# EasyEDA Pro project SprinKlr-8 Rev1.epro, schematic Schematic1
Board Name: Board1; Create Date: 2026-05-14; Page Name: P1; Project Name: SprinKlr-8 (John Sierra); Schematic Name: Schematic1; Update Date: 2026-05-18; Company: SprinKlr-8; Drawn: 15-May 2026; Page Size: A2; Version: V1.0
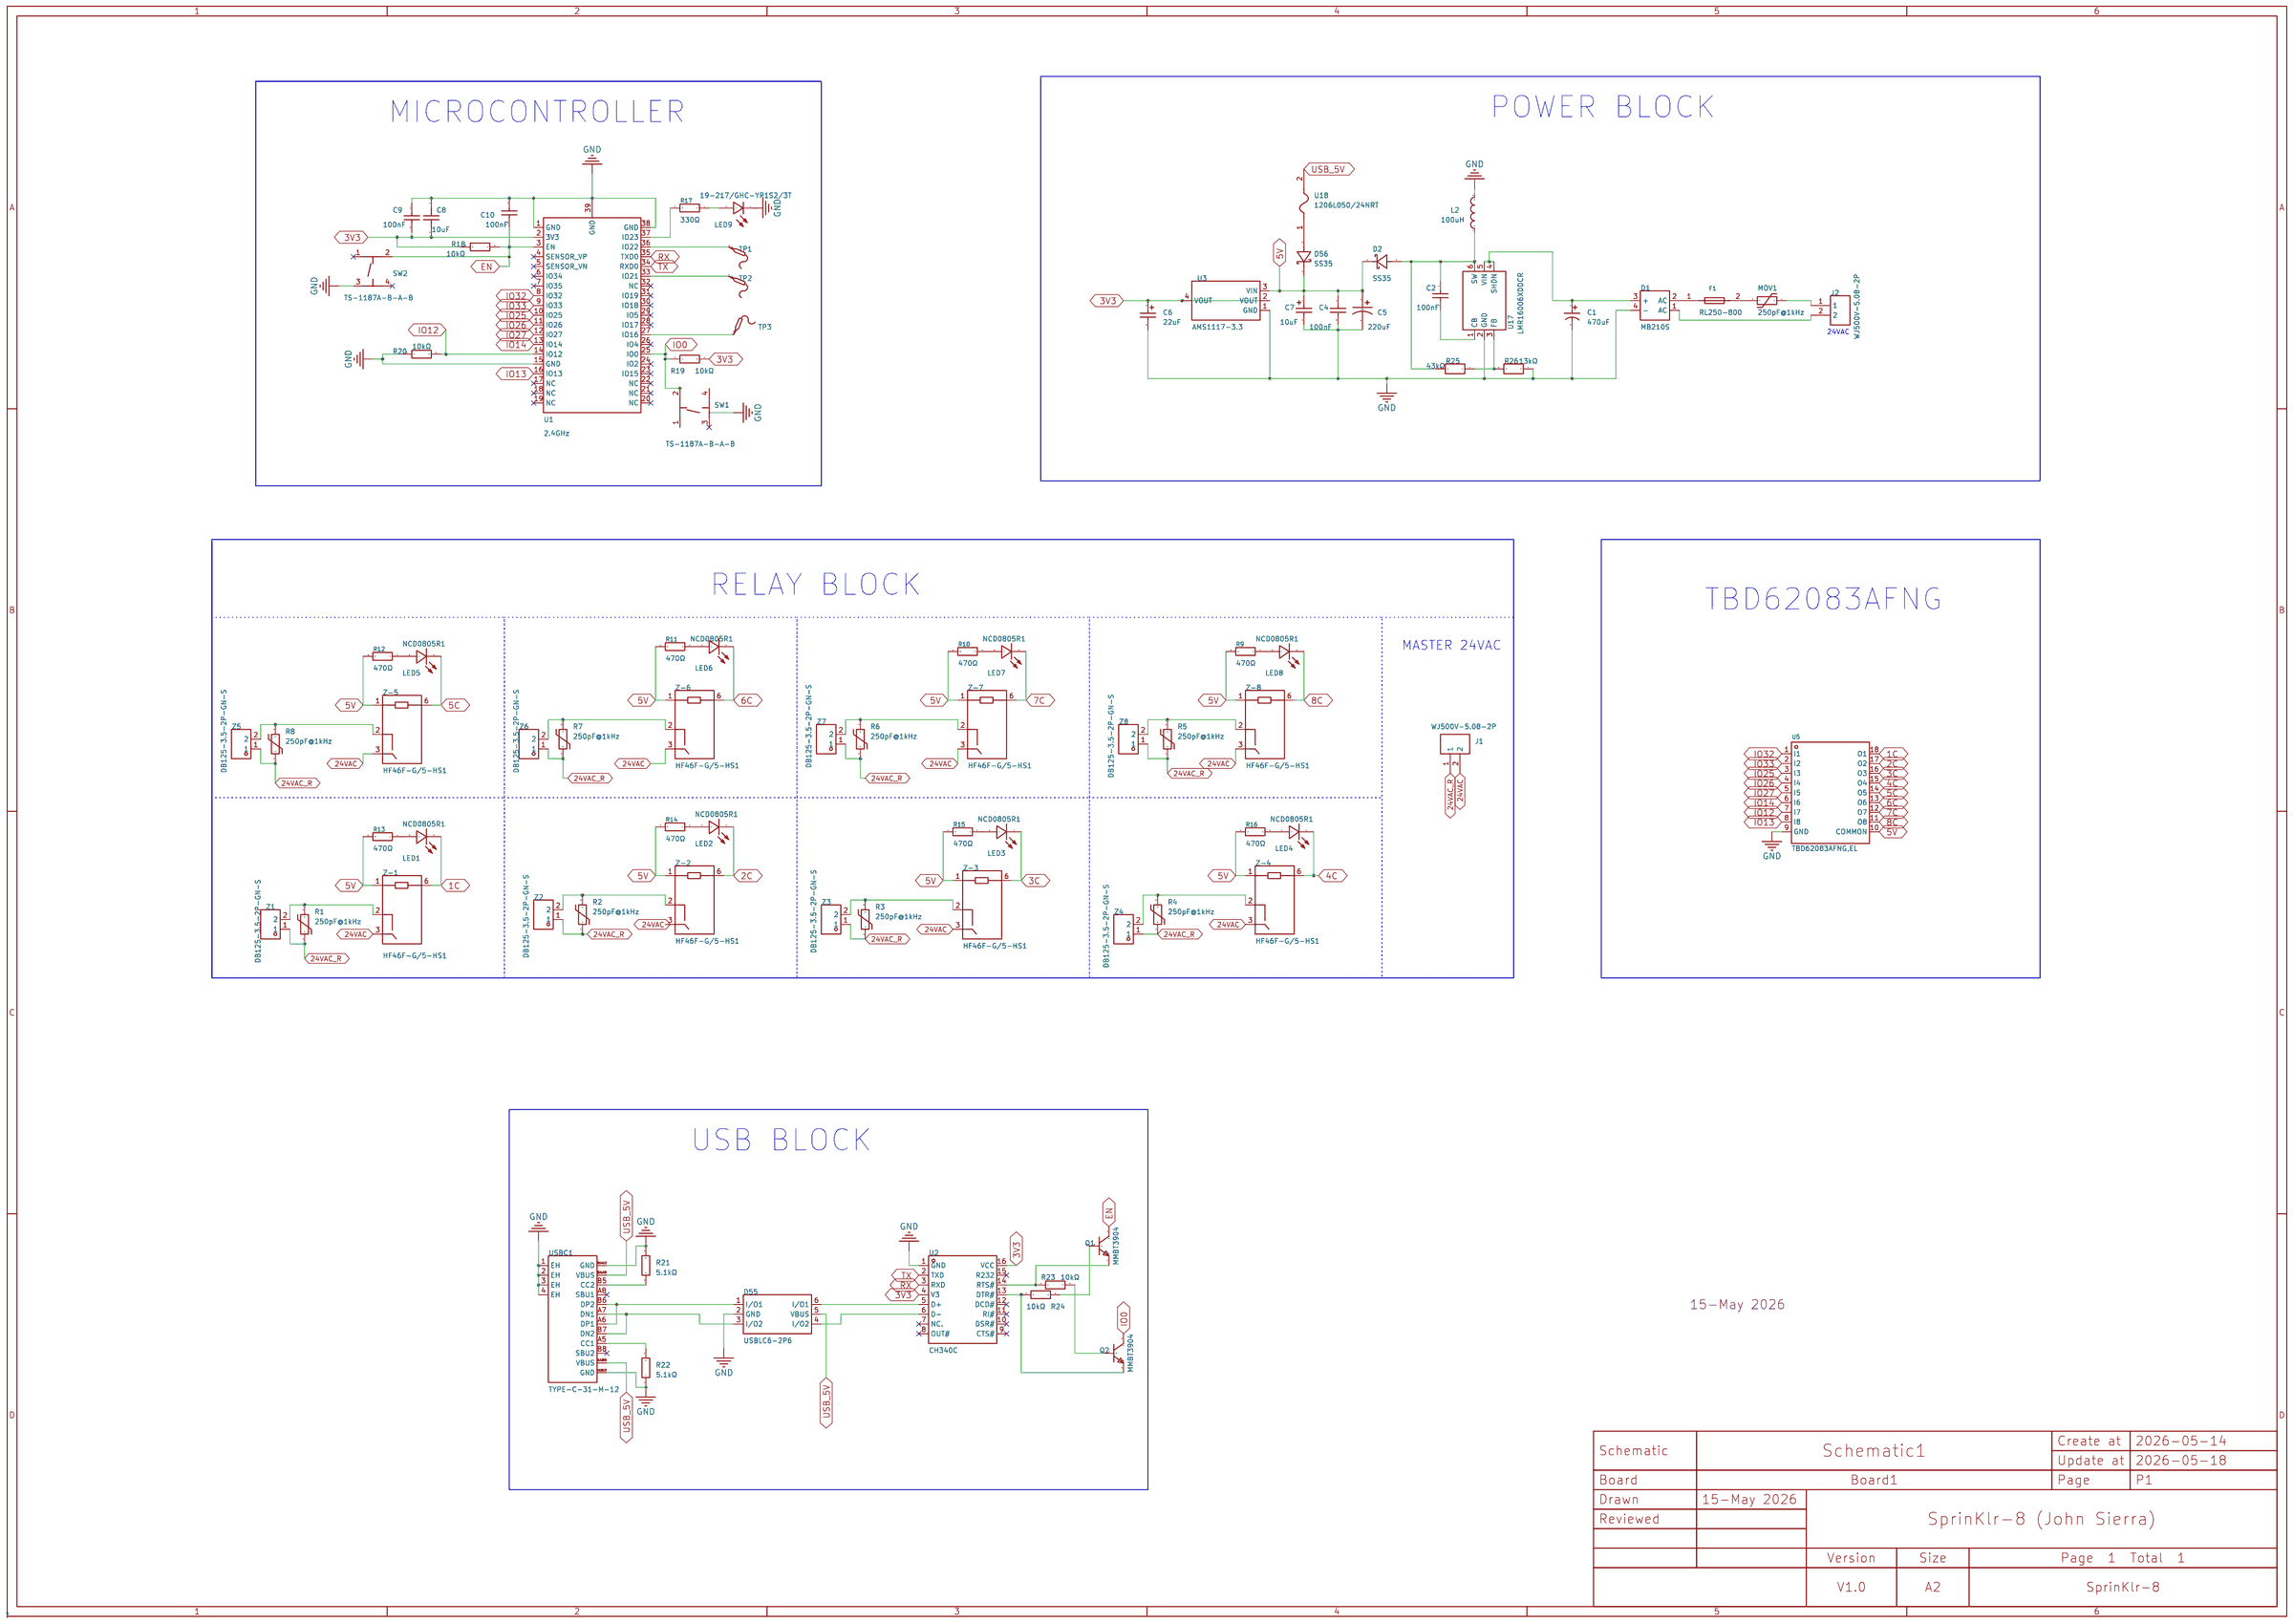
[diagram p0: schematic sheet]

## Parts
C1  470uF  [CAP-TH_BD13.0-P5.00-D1.2-FD]
C2  100nF  [C0805]
C4  100nF  [C0805]
C5  220uF  [CAP-TH_BD10.0-P5.00-D1.0-FD]
C6  22uF  [CASE-A_3216]
C7  10uF  [CAP-SMD_L3.2-W1.6-RD-C7171]
C8  10uF  [C0805]
C9  100nF  [C0805]
C10  100nF  [C0805]
D1  MB210S  [MBS_L4.7-W4.0-P2.50-LS7.0-BL]
D2  SS35  [SMC_L6.9-W5.9-LS7.9-RD]
D55  USBLC6-2P6  [SOT-666-6_L1.6-W1.2-P0.50-LS1.6-BL]
D56  SS35  [SMC_L6.9-W5.9-LS7.9-RD]
F1  RL250-800  [FUSE-TH_L20.0-W4.5-P5.10-D0.8-S3.70]
J1  WJ500V-5.08-2P  [CONN-TH_2P-P5.00_WJ500V-5.08-2P]
J2  WJ500V-5.08-2P  [CONN-TH_2P-P5.00_WJ500V-5.08-2P]
L2  100uH  [IND-SMD_L11.5-W10.0]
LED1  NCD0805R1  [LED0805-RD]
LED2  NCD0805R1  [LED0805-RD]
LED3  NCD0805R1  [LED0805-RD]
LED4  NCD0805R1  [LED0805-RD]
LED5  NCD0805R1  [LED0805-RD]
LED6  NCD0805R1  [LED0805-RD]
LED7  NCD0805R1  [LED0805-RD]
LED8  NCD0805R1  [LED0805-RD]
LED9  19-217/GHC-YR1S2/3T  [LED0603-RD]
MOV1  250pF@1kHz  [RES-TH_L7.5-W4.6-P5.00-D1.2-S2.00]
Q1  MMBT3904  [SOT-23-3_L2.9-W1.3-P1.90-LS2.4-BR]
Q2  MMBT3904  [SOT-23-3_L2.9-W1.3-P1.90-LS2.4-BR]
R1  250pF@1kHz  [RES-TH_L7.5-W4.6-P5.00-D1.2-S2.00]
R2  250pF@1kHz  [RES-TH_L7.5-W4.6-P5.00-D1.2-S2.00]
R3  250pF@1kHz  [RES-TH_L7.5-W4.6-P5.00-D1.2-S2.00]
R4  250pF@1kHz  [RES-TH_L7.5-W4.6-P5.00-D1.2-S2.00]
R5  250pF@1kHz  [RES-TH_L7.5-W4.6-P5.00-D1.2-S2.00]
R6  250pF@1kHz  [RES-TH_L7.5-W4.6-P5.00-D1.2-S2.00]
R7  250pF@1kHz  [RES-TH_L7.5-W4.6-P5.00-D1.2-S2.00]
R8  250pF@1kHz  [RES-TH_L7.5-W4.6-P5.00-D1.2-S2.00]
R9  470Ω  [R0805]
R10  470Ω  [R0805]
R11  470Ω  [R0805]
R12  470Ω  [R0805]
R13  470Ω  [R0805]
R14  470Ω  [R0805]
R15  470Ω  [R0805]
R16  470Ω  [R0805]
R17  330Ω  [R0805]
R18  10kΩ  [R0402]
R19  10kΩ  [R0402]
R20  10kΩ  [R0402]
R21  5.1kΩ  [R0805]
R22  5.1kΩ  [R0805]
R23  10kΩ  [R0402]
R24  10kΩ  [R0402]
R25  43kΩ  [R0603]
R26  13kΩ  [R0603]
SW1  TS-1187A-B-A-B  [SW-SMD_4P-L5.1-W5.1-P3.70-LS6.5-TL_H1.5]
SW2  TS-1187A-B-A-B  [SW-SMD_4P-L5.1-W5.1-P3.70-LS6.5-TL_H1.5]
TP1  -  [Test-Point-0.5mm]  (no BOM)
TP2  -  [Test-Point-0.5mm]  (no BOM)
TP3  -  [Test-Point-0.5mm]  (no BOM)
U1  2.4GHz  [WIFI-SMD_ESP32-WROOM-32E]
U2  CH340C  [SOP-16_L10.0-W3.9-P1.27-LS6.0-BL]
U3  AMS1117-3.3  [SOT-223-3_L6.5-W3.4-P2.30-LS7.0-BR]
U5  TBD62083AFNG,EL  [SSOP-18_L6.8-W4.4-P0.65-LS6.4-BL]
U17  LMR16006XDDCR  [SOT-23-6_L2.9-W1.6-P0.95-LS2.8-BR]
U18  1206L050/24NRT  [F1206]
USBC1  TYPE-C-31-M-12  [USB-C_SMD-TYPE-C-31-M-12_1]
Z1  DB125-3.5-2P-GN-S  [CONN-TH_2P-P3.50_L7.4-W7.0]
Z2  DB125-3.5-2P-GN-S  [CONN-TH_2P-P3.50_L7.4-W7.0]
Z3  DB125-3.5-2P-GN-S  [CONN-TH_2P-P3.50_L7.4-W7.0]
Z4  DB125-3.5-2P-GN-S  [CONN-TH_2P-P3.50_L7.4-W7.0]
Z5  DB125-3.5-2P-GN-S  [CONN-TH_2P-P3.50_L7.4-W7.0]
Z6  DB125-3.5-2P-GN-S  [CONN-TH_2P-P3.50_L7.4-W7.0]
Z7  DB125-3.5-2P-GN-S  [CONN-TH_2P-P3.50_L7.4-W7.0]
Z8  DB125-3.5-2P-GN-S  [CONN-TH_2P-P3.50_L7.4-W7.0]
Z-1  HF46F-G/5-HS1  [RELAYS-TH_HF46F-G-XX-HS1-XXX]
Z-2  HF46F-G/5-HS1  [RELAYS-TH_HF46F-G-XX-HS1-XXX]
Z-3  HF46F-G/5-HS1  [RELAYS-TH_HF46F-G-XX-HS1-XXX]
Z-4  HF46F-G/5-HS1  [RELAYS-TH_HF46F-G-XX-HS1-XXX]
Z-5  HF46F-G/5-HS1  [RELAYS-TH_HF46F-G-XX-HS1-XXX]
Z-6  HF46F-G/5-HS1  [RELAYS-TH_HF46F-G-XX-HS1-XXX]
Z-7  HF46F-G/5-HS1  [RELAYS-TH_HF46F-G-XX-HS1-XXX]
Z-8  HF46F-G/5-HS1  [RELAYS-TH_HF46F-G-XX-HS1-XXX]

## Library data of the parts
C1 = ERF1HM471K16OT: Capacitance:470uF Tolerance:±20% Tolerance:±20% Voltage Rating:50V Ripple Current:- Equivalent Series Resistance(ESR):- Pin Spacing:5mm Diameter:13mm Height - Seated (Max):16mm Lifetime:6000hrs@105℃; LCSC Part Name: 470uF ±20% 50V; Supplier Part: C106527; Manufacturer: AISHI(艾华集团); Supplier Footprint: 插件,D13xL16mm; JLCPCB Part Class: Extended Part; Datasheet: https://item.szlcsc.com/datasheet/ERF1HM471K16OT/107743.html; Supplier: LCSC; Tolerance: ±20%; Voltage Rating: 50V; Pin Spacing: 5mm; Diameter: 13mm; Height - Seated (Max): 16mm; Lifetime: 6000hrs@105℃
C2 C4 C9 C10 = CL21B104KCFNNNE: Capacitance:100nF Tolerance:±10% Tolerance:±10% Voltage Rating:100V Temperature Coefficient:X7R; LCSC Part Name: 100nF ±10% 100V; Supplier Part: C28233; Manufacturer: SAMSUNG(三星); Supplier Footprint: 0805; JLCPCB Part Class: Basic Part; Datasheet: https://item.szlcsc.com/datasheet/CL21B104KCFNNNE/28983.html; Supplier: LCSC; Tolerance: ±10%; Voltage Rating: 100V; Temperature Coefficient: X7R
C5 = SHG220UF50V01EC1210: Capacitance:220uF Tolerance:±20% Tolerance:±20% Voltage Rating:50V Ripple Current:1A@100kHz Equivalent Series Resistance(ESR):84mΩ@100kHz Pin Spacing:5mm Diameter:10mm Height - Seated (Max):13mm Lifetime:5000hrs@105℃ Operating Temperature:-40℃~+105℃ Opera; LCSC Part Name: 220uF ±20% 50V; Supplier Part: C3034843; Manufacturer: KNSCHA(科尼盛); Supplier Footprint: 插件,D10xL13mm; JLCPCB Part Class: Extended Part; Datasheet: https://item.szlcsc.com/datasheet/SHG220UF50V01EC1210/3581003.html; Supplier: LCSC; Tolerance: ±20%; Voltage Rating: 50V; Ripple Current: 1A@100kHz; Equivalent Series Resistance(ESR): 84mΩ@100kHz; Pin Spacing: 5mm; Diameter: 10mm; Height - Seated (Max): 13mm; Lifetime: 5000hrs@105℃; Operating Temperature: -40℃~+105℃
C6 = TAJA226K010RNJ: Capacitance:22uF Tolerance:±10% Tolerance:±10% Voltage Rating:10V Equivalent Series Resistance(ESR):3Ω@100kHz Operating Temperature:-55℃~+125℃ Operating Temperature:-55℃~+125℃; LCSC Part Name: 22uF ±10% 10V; Supplier Part: C11366; Manufacturer: Kyocera AVX; Supplier Footprint: CASE-A-3216-18(mm); JLCPCB Part Class: Extended Part; Supplier: LCSC; Tolerance: ±10%; Voltage Rating: 10V; Equivalent Series Resistance(ESR): 3Ω@100kHz; Operating Temperature: -55℃~+125℃
C7 = TAJA106K016RNJ: Capacitance:10uF Tolerance:±10% Tolerance:±10% Voltage Rating:16V Equivalent Series Resistance(ESR):3Ω@100kHz Operating Temperature:-55℃~+125℃ Operating Temperature:-55℃~+125℃; LCSC Part Name: 10uF ±10% 16V; Supplier Part: C7171; Manufacturer: Kyocera AVX; Supplier Footprint: CASE-A-3216-18(mm); JLCPCB Part Class: Basic Part; Supplier: LCSC; Tolerance: ±10%; Voltage Rating: 16V; Equivalent Series Resistance(ESR): 3Ω@100kHz; Operating Temperature: -55℃~+125℃
C8 = CL21A106KAYNNNE_C15850: Capacitance:10uF Tolerance:±10% Tolerance:±10% Voltage Rating:25V Temperature Coefficient:X5R; LCSC Part Name: 10uF ±10% 25V; Supplier Part: C15850; Manufacturer: SAMSUNG(三星); Manufacturer Part: CL21A106KAYNNNE; Supplier Footprint: 0805; JLCPCB Part Class: Basic Part; Datasheet: https://item.szlcsc.com/datasheet/CL21A106KAYNNNE/16532.html; Supplier: LCSC; Tolerance: ±10%; Voltage Rating: 25V; Temperature Coefficient: X5R
D1 = MB210S_C382839: Voltage - Forward(Vf@If):850mV@2A Voltage - DC Reverse(Vr):100V Current - Rectified:2A Reverse Leakage Current (Ir):300uA@100V Non-Repetitive Peak Forward Surge Current:40A Operating Junction Temperature Range:-55℃~+150℃ Operating Junction Temperature Ran; LCSC Part Name: 耐压:100V 电流:2A; Supplier Part: C382839; Manufacturer: 晶导微电子; Supplier Footprint: MBS; JLCPCB Part Class: Extended Part; Datasheet: https://item.szlcsc.com/datasheet/MB210S/355971.html; Supplier: LCSC; Voltage - Forward(Vf@If): 850mV@2A; Voltage - DC Reverse(Vr): 100V; Current - Rectified: 2A; Reverse Leakage Current (Ir): 300uA@100V; Non-Repetitive Peak Forward Surge Current: 40A; Operating Junction Temperature Range: -55℃~+150℃
D2 D56 = SS35: Diode Configuration:Independent Voltage - Forward(Vf@If):750mV@3A Voltage - DC Reverse(Vr):50V Current - Rectified:3A Reverse Leakage Current (Ir):500uA@50V Operating Junction Temperature Range:-55℃~+150℃ Operating Junction Temperature Range:-55℃~+150℃ No; LCSC Part Name: 电压:50V 电流:3A; Supplier Part: C719834; Manufacturer: onsemi(安森美); Supplier Footprint: DO-214AB(SMC); JLCPCB Part Class: Extended Part; Datasheet: https://item.szlcsc.com/datasheet/SS35/762693.html; Supplier: LCSC; Diode Configuration: Independent; Voltage - Forward(Vf@If): 750mV@3A; Voltage - DC Reverse(Vr): 50V; Current - Rectified: 3A; Reverse Leakage Current (Ir): 500uA@50V; Operating Junction Temperature Range: -55℃~+150℃; Non-Repetitive Peak Forward Surge Current: 100A
D55 = USBLC6-2P6: polarity:Unidirectional Reverse Stand-Off Voltage (Vrwm):5V Maximum Clamping Voltage:14V Peak Pulse Current (Ipp):5.5A Peak Pulse Power Dissipation (Ppp):80W Breakdown Voltage:6V Reverse Leakage Current (Ir):80nA Number of Lines:Dual channel Operating Tem; LCSC Part Name: MSL=3; Supplier Part: C2827693; Manufacturer: TECH PUBLIC(台舟); Supplier Footprint: SOT-666-6; JLCPCB Part Class: Extended Part; Datasheet: https://atta.szlcsc.com/upload/public/pdf/source/20210810/36353A9194EA9F4E33F8AE18BE051AEA.pdf; Supplier: LCSC; polarity: Unidirectional; Reverse Stand-Off Voltage (Vrwm): 5V; Maximum Clamping Voltage: 14V; Peak Pulse Current (Ipp): 5.5A; Peak Pulse Power Dissipation (Ppp): 80W; Breakdown Voltage: 6V; Reverse Leakage Current (Ir): 80nA; Number of Lines: Dual channel; Operating Temperature: -55℃~+125℃; level of protection: IEC 61000-4-2; Type: ESD
F1 = RL250-800: Voltage - Max:250V Current - Max:5A Hold Current:800mA Trip Current:1.6A Power Dissipation:3.5W Resistance - Initial (Ri) (Min):400mΩ Resistance - Post Trip (R1) (Max):3Ω Time to Trip(Max):18s Length:20mm Width:22mm Height:- Pitch:-; LCSC Part Name: 250V 800mA 插件自恢复; Supplier Part: C20866; Manufacturer: RUILON(瑞隆源); Supplier Footprint: 插件,P=5.1mm; JLCPCB Part Class: Extended Part; Datasheet: https://item.szlcsc.com/datasheet/RL250-800/21578.html; Supplier: LCSC; Voltage - Max: 250V; Current - Max: 5A; Hold Current: 800mA; Trip Current: 1.6A; Power Dissipation: 3.5W; Resistance - Initial (Ri) (Min): 400mΩ; Resistance - Post Trip (R1) (Max): 3Ω; Time to Trip(Max): 18s; Length: 20mm; Width: 22mm
J1 J2 = WJ500V-5.08-2P: Structure:1x2P Pitch:5.08mm Color:Green Mounting Style:Direct Insert Current Rating (Max):18A Voltage Rating (Max):250V Number of Pins:2P Number of Rows:1 Wire Gauge - AWG:14~30 Wire Gauge - AWG:14~30 Wire Gauge - mm2:2.5 Wire Gauge - mm2:2.5 Number of PI; LCSC Part Name: 1x2P 5.08mm 直插 排数:1 每排P数:2; Supplier Part: C8465; Manufacturer: KANGNEX(康奈克斯电气); Supplier Footprint: 插件,P=5.08mm; JLCPCB Part Class: Extended Part; Datasheet: https://atta.szlcsc.com/upload/public/pdf/source/20191225/C8465_02D34CE5B5B4A53DF5891601D97FA9F4.pdf; Supplier: LCSC; Structure: 1x2P; Pitch: 5.08mm; Color: Green; Mounting Style: Direct Insert; Current Rating (Max): 18A; Voltage Rating (Max): 250V; Number of Pins: 2P; Number of Rows: 1; Wire Gauge - AWG: 14~30; Wire Gauge - mm2: 2.5; Number of PINs Per Row: 2; Operating Temperature Range: -40℃~+105℃; Screw Specification: M2.5
L2 = PSPMAA1050H-101M-ANP: Inductance:100uH Tolerance:±20% Tolerance:±20% Current Rating:3A Current - Saturation(Isat):4A DC Resistance(DCR):260mΩ Type:Molded Inductor Ratings:-; LCSC Part Name: 100uH ±20%; Supplier Part: C5273830; Manufacturer: PROD(谱罗德); Supplier Footprint: SMD,11.5x10mm; JLCPCB Part Class: Extended Part; Datasheet: https://item.szlcsc.com/datasheet/PSPMAA1050H-101M-ANP/6003680.html; Supplier: LCSC; Tolerance: ±20%; Current Rating: 3A; Current - Saturation(Isat): 4A; DC Resistance(DCR): 260mΩ; Type: Molded Inductor
LED1-LED8 = NCD0805R1_C84256: Lamp Holder Type:- Illumination Color:Red Voltage - Forward(Vf):1.6V~2.6V Voltage - Forward(Vf):1.6V~2.6V Power(Watts):65mW Forward Current:25mA Wavelength - Dominant:615nm~630nm Wavelength - Dominant:615nm~630nm Peak Wavelength:630nm Diode Configuration:; LCSC Part Name: 片式发光二极管; Supplier Part: C84256; Manufacturer: 国星光电; Supplier Footprint: 0805; JLCPCB Part Class: Basic Part; Datasheet: https://item.szlcsc.com/datasheet/NCD0805R1/85425.html; Supplier: LCSC; Illumination Color: Red; Voltage - Forward(Vf): 1.6V~2.6V; Power(Watts): 65mW; Forward Current: 25mA; Wavelength - Dominant: 615nm~630nm; Peak Wavelength: 630nm; Diode Configuration: Discrete Diode; Luminous Intensity: 195mcd; Viewing Angle: 130°; Operating Temperature: -30℃~+85℃
LED9 = 19-217/GHC-YR1S2/3T: Lamp Holder Type:- Illumination Color:Emerald Green Voltage - Forward(Vf):3.3V Voltage - Forward(Vf):3.3V Power(Watts):110mW Forward Current:20mA Wavelength - Dominant:520nm~535nm Wavelength - Dominant:520nm~535nm Peak Wavelength:518nm Diode Configuration; LCSC Part Name: 翠绿 停产; Supplier Part: C72043; Manufacturer: EVERLIGHT(亿光); Supplier Footprint: 0603; JLCPCB Part Class: Extended Part; Supplier: LCSC; Illumination Color: Emerald Green; Voltage - Forward(Vf): 3.3V; Power(Watts): 110mW; Forward Current: 20mA; Wavelength - Dominant: 520nm~535nm; Peak Wavelength: 518nm; Diode Configuration: Discrete Diode; Lens Color: Water Clear; Luminous Intensity: 199mcd; Viewing Angle: 120°; Operating Temperature: -40℃~+85℃
MOV1 R1-R8 = STE05D101K1BN0FSB0R0: Varistor Voltage:90V~110V Varistor Voltage:90V~110V Clamping Voltage:175V Maximum DC Volts:85V Maximum AC Volts:60V Peak Current:200A Energy:3J Energy:3J Capacitance:250pF@1kHz Rated Wattage:100mW Pitch:5mm; LCSC Part Name: 钳位电压175V 3焦耳 插件压敏电阻; Supplier Part: C362788; Manufacturer: STE(松田); Supplier Footprint: 插件,P=5mm; JLCPCB Part Class: Extended Part; Datasheet: https://item.szlcsc.com/datasheet/STE05D101K1BN0FSB0R0/337386.html; Supplier: LCSC; Varistor Voltage: 90V~110V; Clamping Voltage: 175V; Maximum DC Volts: 85V; Maximum AC Volts: 60V; Peak Current: 200A; Energy: 3J; Rated Wattage: 100mW; Pitch: 5mm
Q1 Q2 = MMBT3904(RANGE:100-300): type:NPN Current - Collector(Ic):200mA Collector - Emitter Voltage VCEO:40V Pd - Power Dissipation:200mW DC Current Gain:100@10mA,1V DC Current Gain:100@10mA,1V Transition frequency(fT):300MHz Current - Collector Cutoff:100nA Vce Saturation(VCE(sat)):300m; LCSC Part Name: hfe=100~300 NPN 电流:200mA 电压:40V; Supplier Part: C20526; Manufacturer: CJ(江苏长电/长晶); Supplier Footprint: SOT-23; JLCPCB Part Class: Basic Part; Datasheet: https://item.szlcsc.com/datasheet/MMBT3904(RANGE%253A100-300)/21237.html; Supplier: LCSC; type: NPN; Current - Collector(Ic): 200mA; Collector - Emitter Voltage VCEO: 40V; Pd - Power Dissipation: 200mW; DC Current Gain: 100@10mA,1V; Transition frequency(fT): 300MHz; Current - Collector Cutoff: 100nA; Vce Saturation(VCE(sat)): 300mV@50mA,5mA; Operating Temperature: -55℃~+150℃; Emitter-Base Voltage(Vebo): 6V; Number: 1 NPN
R9-R16 = 0805W8F4700T5E: Type:Thick Film Resistor Resistance:470Ω Tolerance:±1% Tolerance:±1% Power(Watts):125mW Voltage-Supply(Max):150V Temperature Coefficient:±100ppm/℃ Temperature Coefficient:±100ppm/℃ Operating Temperature:-55℃~+155℃ Operating Temperature:-55℃~+155℃; LCSC Part Name: 470Ω ±1% 125mW 厚膜电阻; Supplier Part: C17710; Manufacturer: UNI-ROYAL(厚声); Supplier Footprint: 0805; JLCPCB Part Class: Basic Part; Datasheet: https://item.szlcsc.com/datasheet/0805W8F4700T5E/18398.html; Supplier: LCSC; Type: Thick Film Resistor; Tolerance: ±1%; Power(Watts): 125mW; Voltage-Supply(Max): 150V; Temperature Coefficient: ±100ppm/℃; Operating Temperature: -55℃~+155℃
R17 = 0805W8F3300T5E: Type:Thick Film Resistor Resistance:330Ω Tolerance:±1% Tolerance:±1% Power(Watts):125mW Voltage-Supply(Max):150V Temperature Coefficient:±100ppm/℃ Temperature Coefficient:±100ppm/℃ Operating Temperature:-55℃~+155℃ Operating Temperature:-55℃~+155℃; LCSC Part Name: 330Ω ±1% 125mW 厚膜电阻; Supplier Part: C17630; Manufacturer: UNI-ROYAL(厚声); Supplier Footprint: 0805; JLCPCB Part Class: Basic Part; Datasheet: https://item.szlcsc.com/datasheet/0805W8F3300T5E/18318.html; Supplier: LCSC; Type: Thick Film Resistor; Tolerance: ±1%; Power(Watts): 125mW; Voltage-Supply(Max): 150V; Temperature Coefficient: ±100ppm/℃; Operating Temperature: -55℃~+155℃
R18-R20 R23 R24 = 0402WGF1002TCE: Type:Thick Film Resistor Resistance:10kΩ Tolerance:±1% Tolerance:±1% Power(Watts):62.5mW Voltage-Supply(Max):50V Temperature Coefficient:±100ppm/℃ Temperature Coefficient:±100ppm/℃ Operating Temperature:-55℃~+155℃ Operating Temperature:-55℃~+155℃; LCSC Part Name: 10kΩ ±1% 62.5mW 厚膜电阻; Supplier Part: C25744; Manufacturer: UNI-ROYAL(厚声); Supplier Footprint: 0402; JLCPCB Part Class: Basic Part; Datasheet: https://item.szlcsc.com/datasheet/0402WGF1002TCE/26487.html; Supplier: LCSC; Type: Thick Film Resistor; Tolerance: ±1%; Power(Watts): 62.5mW; Voltage-Supply(Max): 50V; Temperature Coefficient: ±100ppm/℃; Operating Temperature: -55℃~+155℃
R21 R22 = 0805W8F5101T5E: Type:Thick Film Resistor Resistance:5.1kΩ Tolerance:±1% Tolerance:±1% Power(Watts):125mW Voltage-Supply(Max):150V Temperature Coefficient:±100ppm/℃ Temperature Coefficient:±100ppm/℃ Operating Temperature:-55℃~+155℃ Operating Temperature:-55℃~+155℃; LCSC Part Name: 5.1kΩ ±1% 125mW 厚膜电阻; Supplier Part: C27834; Manufacturer: UNI-ROYAL(厚声); Supplier Footprint: 0805; JLCPCB Part Class: Basic Part; Datasheet: https://item.szlcsc.com/datasheet/0805W8F5101T5E/28584.html; Supplier: LCSC; Type: Thick Film Resistor; Tolerance: ±1%; Power(Watts): 125mW; Voltage-Supply(Max): 150V; Temperature Coefficient: ±100ppm/℃; Operating Temperature: -55℃~+155℃
R25 = FRC0603F4302TS: Type:Thick Film Resistor Resistance:43kΩ Tolerance:±1% Tolerance:±1% Power(Watts):100mW Voltage-Supply(Max):75V Temperature Coefficient:±100ppm/℃ Temperature Coefficient:±100ppm/℃ Operating Temperature:-55℃~+155℃ Operating Temperature:-55℃~+155℃; LCSC Part Name: 43kΩ ±1% 100mW 厚膜电阻; Supplier Part: C2907038; Manufacturer: FOJAN(富捷); Supplier Footprint: 0603; JLCPCB Part Class: Extended Part; Supplier: LCSC; Type: Thick Film Resistor; Tolerance: ±1%; Power(Watts): 100mW; Voltage-Supply(Max): 75V; Temperature Coefficient: ±100ppm/℃; Operating Temperature: -55℃~+155℃
R26 = FRC0603F1302TS: Type:Thick Film Resistor Resistance:13kΩ Tolerance:±1% Tolerance:±1% Power(Watts):100mW Voltage-Supply(Max):75V Temperature Coefficient:±100ppm/℃ Temperature Coefficient:±100ppm/℃ Operating Temperature:-55℃~+155℃ Operating Temperature:-55℃~+155℃; LCSC Part Name: 13kΩ ±1% 100mW 厚膜电阻; Supplier Part: C2906992; Manufacturer: FOJAN(富捷); Supplier Footprint: 0603; JLCPCB Part Class: Extended Part; Supplier: LCSC; Type: Thick Film Resistor; Tolerance: ±1%; Power(Watts): 100mW; Voltage-Supply(Max): 75V; Temperature Coefficient: ±100ppm/℃; Operating Temperature: -55℃~+155℃
SW1 SW2 = TS-1187A-B-A-B: Circuit:SPST Actuator Style:Round Button Operating Force:1.6N Mounting Type:Surface Mount,Vertical Length:5.1mm Width:5.1mm Switch Height:1.5mm with Bracket:Without Bracket Contact Current:50mA Voltage Rating:12V Actuator/Cap Color:Gold With Lamp:No Life:; LCSC Part Name: 5.1*5.1*1.5mm 立贴 轻触开关; Supplier Part: C318884; Manufacturer: XKB Connection(中国星坤); Supplier Footprint: SMD; JLCPCB Part Class: Basic Part; Datasheet: https://item.szlcsc.com/datasheet/TS-1187A-B-A-B/299976.html; Supplier: LCSC; Circuit: SPST; Actuator Style: Round Button; Operating Force: 1.6N; Mounting Type: Surface Mount,Vertical; Length: 5.1mm; Width: 5.1mm; Switch Height: 1.5mm; with Bracket: Without Bracket; Contact Current: 50mA; Voltage Rating: 12V; Actuator/Cap Color: Gold; With Lamp: No; Life: 100,000 Cycles; Operating Temperature: -30℃~+85℃
TP1-TP3 = Test-Point: Test Point 测试点
U1 = ESP32-WROOM-32E-N4: Utilized IC / Part:ESP32-D0WDR2-V3；ESP32-D0WD-V3 Wireless Standard:Bluetooth4.2 Interface Type:I2C；GPIO；UART；SPI；SDIO Frequency:2.4GHz Antenna Type:On-board PCB Antenna Output Power:20dBm Output Power:20dBm Voltage - Supply:3V~3.6V Voltage - Supply:3V~3.6; LCSC Part Name: 不带固件 通用型Wi-Fi+BT+BLE MCU模组; Supplier Part: C701341; Manufacturer: ESPRESSIF(乐鑫); Supplier Footprint: SMD,25.5x18mm; JLCPCB Part Class: Extended Part; Datasheet: https://item.szlcsc.com/datasheet/ESP32-WROOM-32E-N4/736349.html; Supplier: LCSC; Utilized IC / Part: ESP32-D0WDR2-V3；ESP32-D0WD-V3; Wireless Standard: Bluetooth4.2; Interface Type: I2C；GPIO；UART；SPI；SDIO; Antenna Type: On-board PCB Antenna; Output Power: 20dBm; Voltage - Supply: 3V~3.6V; Receive  Current: 112mA; Send  Current: 239mA; Sensitivity: -98dBm; Operating Temperature: -40℃~+85℃
U2 = CH340C: Applications Function:Transceiver USB Protocol:USB 2.0 Voltage - Supply:3.3V；5V Voltage - Supply:3.3V；5V Data Rate:2Mbps Operating Temperature:-20℃~+70℃ Operating Temperature:-20℃~+70℃ Current - Supply:7mA Supply Current (Iq):50uA; LCSC Part Name: USB转串口芯片; Supplier Part: C84681; Manufacturer: WCH(南京沁恒); Supplier Footprint: SOP-16; JLCPCB Part Class: Extended Part; Datasheet: https://item.szlcsc.com/datasheet/CH340C/85852.html; Supplier: LCSC; Applications Function: Transceiver; USB Protocol: USB 2.0; Voltage - Supply: 3.3V；5V; Data Rate: 2Mbps; Operating Temperature: -20℃~+70℃; Current - Supply: 7mA; Supply Current (Iq): 50uA
U3 = AMS1117-3.3_C6186: Output Type:Fixed Voltage - Supply:15V Output Voltage:3.3V Output Voltage:3.3V Output Current:1A Power Supply Rejection Ratio (PSRR):72dB@(120Hz) Voltage Dropout:1.1V@(800mA) standby current:5mA Noise:0.003%Vout Features:Over Current Protection；Thermal Sh; LCSC Part Name: 3.3V 1A 15V; Supplier Part: C6186; Manufacturer: AMS; Supplier Footprint: SOT-223; JLCPCB Part Class: Basic Part; Datasheet: https://item.szlcsc.com/datasheet/AMS1117-3.3/6652.html; Supplier: LCSC; Output Type: Fixed; Voltage - Supply: 15V; Output Voltage: 3.3V; Output Current: 1A; Power Supply Rejection Ratio (PSRR): 72dB@(120Hz); Voltage Dropout: 1.1V@(800mA); standby current: 5mA; Noise: 0.003%Vout; Features: Over Current Protection；Thermal Shutdown; Operating Temperature: -40℃~+125℃; Output Configuration: Positive; Number of Outputs: 1
U5 = TBD62083AFNG,EL: Type:Low Side Switch Number of Channels:8 Control Input Logic:Active High Voltage - Supply:2.5V~30V Voltage - Supply:2.5V~30V Maximum Continuous Current:500mA RDS(on):700mΩ Features:- Operating Temperature	-:-40℃~+85℃ Operating Temperature	-:-40℃~+85℃; LCSC Part Name: 8通道灌电流型DMoS晶体管阵列; Supplier Part: C163229; Manufacturer: TOSHIBA(东芝); Supplier Footprint: SSOP-18-225mil; JLCPCB Part Class: Extended Part; Datasheet: https://item.szlcsc.com/datasheet/TBD62083AFNG%252CEL/174610.html; Supplier: LCSC; Type: Low Side Switch; Number of Channels: 8; Control Input Logic: Active High; Voltage - Supply: 2.5V~30V; Maximum Continuous Current: 500mA; RDS(on): 700mΩ; Operating Temperature	-: -40℃~+85℃
U17 = LMR16006XDDCR: Function:Step-down type Voltage - Supply:4V~60V Voltage - Supply:4V~60V Output Voltage:765mV~55V Output Voltage:765mV~55V Output Current:600mA Frequency - Switching:700kHz Frequency - Switching:700kHz Operating Temperature:-40℃~+125℃@(TJ) Operating Temper; LCSC Part Name: 降压型 600mA 4V~60V; Supplier Part: C87080; Manufacturer: TI(德州仪器); Supplier Footprint: SOT-6; JLCPCB Part Class: Extended Part; Datasheet: https://www.ti.com/cn/lit/gpn/lmr16006; Supplier: LCSC; Function: Step-down type; Voltage - Supply: 4V~60V; Output Voltage: 765mV~55V; Output Current: 600mA; Frequency - Switching: 700kHz; Operating Temperature: -40℃~+125℃@(TJ); Synchronous Rectifier: No; Number of Outputs: 1; Topology: Buck; Quiescent Current: 28uA; Switch tube (built-in/external): Built-in; Output Type: Adjustable; Features: Light load efficient mode；Cycle-by-cycle current limiting；Overcurrent Protection
U18 = 1206L050/24NRT: Voltage - Max:24V Current - Max:50A Hold Current:500mA Trip Current:1.5A Power Dissipation:1.2W Resistance - Initial (Ri) (Min):90mΩ Resistance - Post Trip (R1) (Max):1.2Ω Time to Trip(Max):100ms Operating Temperature:-40℃~+125℃ Operating Temperature:-40℃; LCSC Part Name: 24V 0.50A 1206 耐高温自恢复; Supplier Part: C28326720; Manufacturer: LUTE(陆特); Supplier Footprint: 1206; JLCPCB Part Class: Extended Part; Datasheet: https://item.szlcsc.com/datasheet/1206L050%252F24NRT/30063196.html; Supplier: LCSC; Voltage - Max: 24V; Current - Max: 50A; Hold Current: 500mA; Trip Current: 1.5A; Power Dissipation: 1.2W; Resistance - Initial (Ri) (Min): 90mΩ; Resistance - Post Trip (R1) (Max): 1.2Ω; Time to Trip(Max): 100ms; Operating Temperature: -40℃~+125℃
USBC1 = TYPE-C-31-M-12: Connector Type:Type-C Protocol Standard:- Gender:Female Mounting Type:Surface Mount, Right Angle Number of Contacts:16P Number of Ports:1 Current Rating-Power:5A Voltage Rating:20V Connect-Disconnect Life:10,000 cycles Length:7.35mm Operating Temperature:; LCSC Part Name: Type-C 母 卧贴; Supplier Part: C165948; Manufacturer: 韩国韩荣; Supplier Footprint: SMD; JLCPCB Part Class: Extended Part; Datasheet: https://item.szlcsc.com/datasheet/TYPE-C-31-M-12/177331.html; Supplier: LCSC; Connector Type: Type-C; Gender: Female; Mounting Type: Surface Mount, Right Angle; Number of Contacts: 16P; Number of Ports: 1; Current Rating-Power: 5A; Voltage Rating: 20V; Connect-Disconnect Life: 10,000 cycles; Length: 7.35mm; Operating Temperature: -30℃~+80℃
Z1-Z8 = DB125-3.5-2P-GN-S: Number of Positions or Pins:1x2P Pitch:3.5mm Color:Green Mounting Type:Through Hole Number of Pins:2P Number of Rows:1 Number of PINs Per Row:2 Screw Specification:M2 Current Rating:10A Voltage Rating (Max):300V Wire Gauge - AWG:16~28 Wire Gauge - mm2:1 W; LCSC Part Name: 1x2P 3.5mm 直插 排数:1 每排P数:2; Supplier Part: C466970; Manufacturer: DORABO(地博电气); Supplier Footprint: 插件,P=3.5mm; JLCPCB Part Class: Extended Part; Datasheet: https://item.szlcsc.com/datasheet/DB125-3.5-2P-GN-S/472410.html; Supplier: LCSC; Number of Positions or Pins: 1x2P; Pitch: 3.5mm; Color: Green; Mounting Type: Through Hole; Number of Pins: 2P; Number of Rows: 1; Number of PINs Per Row: 2; Screw Specification: M2; Current Rating: 10A; Voltage Rating (Max): 300V; Wire Gauge - AWG: 16~28; Wire Gauge - mm2: 1; Operating Temperature: -40℃~+105℃
Z-1-Z-8 = HF46F-G/5-HS1: Coil Voltage:5V Contact Form:One Normally Open: 1A (SPST-NO) Number of Pins:4 Contact Rating:10A@250VAC；10A@30VDC Switching Voltage(Max):277V@AC；30V@DC Coil Rated Power:200mW Contact Material:AgNi Switching Current(Max):10A Coil Type:Non-polar - Single Co; LCSC Part Name: 超小型中功率5V继电器 单刀单掷-常开; Supplier Part: C165255; Manufacturer: HF(宏发); Supplier Footprint: 插件,7x20.5mm; JLCPCB Part Class: Extended Part; Datasheet: https://atta.szlcsc.com/upload/public/pdf/source/20180515/C111537_A684F742B6E0377A70AB6B44CCDD1A7A.pdf; Supplier: LCSC; Coil Voltage: 5V; Contact Form: One Normally Open: 1A (SPST-NO); Number of Pins: 4; Contact Rating: 10A@250VAC；10A@30VDC; Switching Voltage(Max): 277V@AC；30V@DC; Coil Rated Power: 200mW; Contact Material: AgNi; Switching Current(Max): 10A; Coil Type: Non-polar - Single Coil; Coil Resistance: 125Ω; Contact Resistance: 100mΩ; Operate Time: 10ms; Release Time: 10ms; Operating Temperature: -40℃~+85℃

## Nets
3V3: C6.1 C8.2 C9.2 R18.1 R19.2 U1.2(3V3) U2.4(V3) U2.16(VCC) U3.2(VOUT) U3.4(VOUT)
5V: C4.1 C5.1 C7.1 D2.1(C) D56.1(C) R9.2 R10.2 R11.2 R12.2 R13.2 R14.2 R15.2 R16.2 U3.3(VIN) U5.10(COMMON) Z-1.1 Z-2.1 Z-3.1 Z-4.1 Z-5.1 Z-6.1 Z-7.1 Z-8.1
24VAC: J1.2 Z-1.3 Z-2.3 Z-3.3 Z-4.3 Z-5.3 Z-6.3 Z-7.3 Z-8.3
24VAC_R: J1.1 R1.1 R2.1 R3.1 R4.1 R5.1 R6.1 R7.1 R8.1 Z1.1 Z2.1 Z3.1 Z4.1 Z5.1 Z6.1 Z7.1 Z8.1
GND: C1.2 C4.2 C5.2 C6.2 C7.2 C8.1 C9.1 C10.1 D1.4(-) D55.2(GND) L2.2 LED9.1(C) R20.1 R21.2 R22.1 R26.1 SW1.4(D) SW2.3(C) U1.1(GND) U1.15(GND) U1.38(GND) U1.39(GND) U2.1(GND) U3.1(GND) U5.9(GND) U17.2(GND) USBC1.1(EH) USBC1.2(EH) USBC1.3(EH) USBC1.4(EH) USBC1.A1B12(GND) USBC1.B1A12(GND)
1C: LED1.1(-) U5.18(O1) Z-1.6
2C: LED2.1(-) U5.17(O2) Z-2.6
3C: LED3.1(-) U5.16(O3) Z-3.6
4C: LED4.1(-) U5.15(O4) Z-4.6
5C: LED5.1(-) U5.14(O5) Z-5.6
6C: LED6.1(-) U5.13(O6) Z-6.6
7C: LED7.1(-) U5.12(O7) Z-7.6
8C: LED8.1(-) U5.11(O8) Z-8.6
EN: C10.2 Q1.3(C) R18.2 SW2.2(B) U1.3(EN)
IO0: Q2.3(C) R19.1 SW1.1(A) SW1.2(B) U1.25(IO0)
IO12: R20.2 U1.14(IO12) U5.7(I7)
IO13: U1.16(IO13) U5.8(I8)
IO14: U1.13(IO14) U5.6(I6)
IO25: U1.10(IO25) U5.3(I3)
IO26: U1.11(IO26) U5.4(I4)
IO27: U1.12(IO27) U5.5(I5)
IO32: U1.8(IO32) U5.1(I1)
IO33: U1.9(IO33) U5.2(I2)
RX: U1.35(TXD0) U2.3(RXD)
TX: U1.34(RXD0) U2.2(TXD)
USB_5V: D55.5(VBUS) U18.2 USBC1.A4B9(VBUS) USBC1.B4A9(VBUS)
$1N3315: LED8.2(+) R9.1
$1N3354: LED7.2(+) R10.1
$1N3393: LED6.2(+) R11.1
$1N3432: LED5.2(+) R12.1
$1N3508: LED2.2(+) R14.1
$1N3547: LED3.2(+) R15.1
$1N3586: LED4.2(+) R16.1
$1N3625: LED1.2(+) R13.1
$1N6681: D1.1(AC) J2.2
$1N6717: J2.1 MOV1.1
$1N6731: D1.2(AC) F1.1
$1N6785: C1.1 D1.3(+) U17.4(SHDN) U17.5(VIN)
$1N7201: C2.1 D2.2(A) L2.1 R25.2 U17.6(SW)
$1N8527: R17.2 U1.37(IO23)
$1N9069: R21.1 USBC1.B5(CC2)
$1N9075: R22.2 USBC1.A5(CC1)
$1N11753: D55.6(I/O1) U2.5(D+)
$1N11759: D55.1(I/O1) USBC1.A6(DP1) USBC1.B6(DP2)
$1N11762: D55.4(I/O2) U2.6(D-)
$1N11768: D55.3(I/O2) USBC1.A7(DN1) USBC1.B7(DN2)
$1N11893: Q1.2(E) R23.1 U2.14(RTS#)
$1N11932: Q2.2(E) R24.1 U2.13(DTR#)
$1N12077: Q2.1(B) R23.2
$1N12134: Q1.1(B) R24.2
$1N12369: D56.2(A) U18.1
$1N12551: R1.2 Z1.2 Z-1.2
$1N12643: R2.2 Z2.2 Z-2.2
$1N13021: R5.2 Z8.2 Z-8.2
$1N13219: LED9.2(A) R17.1
$1N13226: TP1.1 U1.36(IO22)
$1N13288: TP2.1 U1.33(IO21)
$1N13309: TP3.1 U1.27(IO16)
$1N13317: C2.2 U17.1(CB)
$1N13320: R25.1 R26.2 U17.3(FB)
$1N13341: R4.2 Z4.2 Z-4.2
$1N13344: R3.2 Z3.2 Z-3.2
$1N13347: R8.2 Z5.2 Z-5.2
$1N13350: R7.2 Z6.2 Z-6.2
$1N13353: R6.2 Z7.2 Z-7.2
$1N13379: F1.2 MOV1.2

Not connected (* = marked no-connect by the designer): SW1 3(C)*; SW2 1(A)* 4(D)*; U1 4(SENSOR_VP)* 5(SENSOR_VN)* 6(IO34)* 7(IO35)* 17(NC)* 18(NC)* 19(NC)* 20(NC)* 21(NC)* 22(NC)* 23(IO15)* 24(IO2)* 26(IO4)* 28(IO17)* 29(IO5)* 30(IO18)* 31(IO19)* 32(NC)*; U2 7(NC.)* 8(OUT#)* 9(CTS#)* 10(DSR#)* 11(RI#)* 12(DCD#)* 15(R232)*; USBC1 A8(SBU1)* B8(SBU2)*

## Notes on the sheet
- POWER BLOCK
- MICROCONTROLLER
- 24VAC
- RELAY BLOCK
- TBD62083AFNG
- MASTER 24VAC
- USB BLOCK
